# EAGLE design IrHeliJoy (EAGLE 5.11)
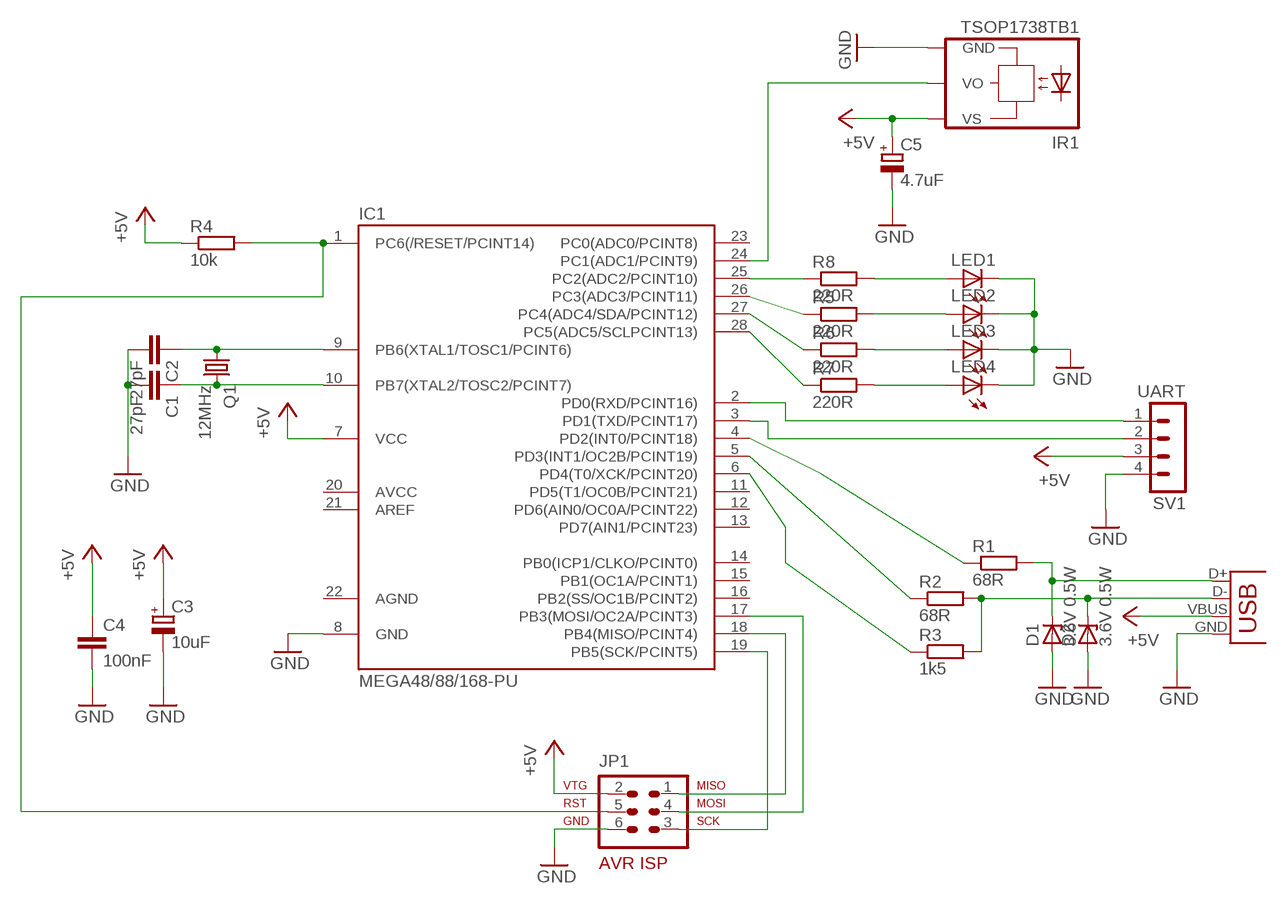
[diagram p0: schematic, sheet 1]

## Parts
C1  27pF  C-EU025-025X050  [C025-025X050]
C2  27pF  C-EU025-025X050  [C025-025X050]
C3  10uF  CPOL-EUE2,5-6E  [E2,5-6E]
C4  100nF  C-EU025-025X050  [C025-025X050]
C5  4.7uF  CPOL-EUE2.5-6  [E2,5-6]
D1  3.6V 0.5W  ZENER-DIODEDO34-7  [DO34Z7]
D2  3.6V 0.5W  ZENER-DIODEDO34-7  [DO34Z7]
IC1  MEGA48/88/168-PU  [DIL28-3]
IR1  TSOP1738TB1  [TSOP17_TB1]
JP1  AVR-ISP-6  [AVR-ISP-6]
LED1  LED3MM  [LED3MM]
LED2  LED3MM  [LED3MM]
LED3  LED3MM  [LED3MM]
LED4  LED3MM  [LED3MM]
Q1  12MHz  CRYSTALHC49U-V  [HC49U-V]
R1  68R  R-EU_0207/12  [0207/12]
R2  68R  R-EU_0207/12  [0207/12]
R3  1k5  R-EU_0207/15  [0207/15]
R4  10k  R-EU_0207/10  [0207/10]
R5  220R  R-EU_0207/10  [0207/10]
R6  220R  R-EU_0207/10  [0207/10]
R7  220R  R-EU_0207/10  [0207/10]
R8  220R  R-EU_0207/10  [0207/10]
SV1  UART  MA04-1  [MA04-1]
X1  USBPTH  [USB-B-PTH]

## Nets
+5V: C3.+ C4.1 C5.+ IC1.7(VCC) IR1.VS JP1.2 R4.1 SV1.3 X1.VBUS
GND: C1.2 C2.2 C3.- C4.2 C5.- D1.A D2.A IC1.8(GND) IR1.GND JP1.6 LED1.K(C) LED2.K(C) LED3.K(C) LED4.K(C) SV1.4 X1.GND
N$1: C1.1 IC1.10(PB7(XTAL2/TOSC2/PCINT7)) Q1.2
N$2: C2.1 IC1.9(PB6(XTAL1/TOSC1/PCINT6)) Q1.1
N$3: D1.C R1.2 X1.D+
N$4: IC1.4(PD2(INT0/PCINT18)) R1.1
N$5: D2.C R2.2 R3.2 X1.D-
N$6: IC1.5(PD3(INT1/OC2B/PCINT19)) R2.1
N$7: IC1.6(PD4(T0/XCK/PCINT20)) R3.1
N$8: IC1.25(PC2(ADC2/PCINT10)) R8.1
N$9: LED1.A R8.2
N$10: IC1.1(PC6(/RESET/PCINT14)) JP1.5 R4.2
N$11: IC1.18(PB4(MISO/PCINT4)) JP1.1
N$12: LED2.A R5.2
N$13: IC1.19(PB5(SCK/PCINT5)) JP1.3
N$14: IC1.17(PB3(MOSI/OC2A/PCINT3)) JP1.4
N$15: LED3.A R6.2
N$16: LED4.A R7.2
N$17: IC1.26(PC3(ADC3/PCINT11)) R5.1
N$18: IC1.27(PC4(ADC4/SDA/PCINT12)) R6.1
N$19: IC1.28(PC5(ADC5/SCLPCINT13)) R7.1
N$20: IC1.24(PC1(ADC1/PCINT9)) IR1.VO
N$21: IC1.2(PD0(RXD/PCINT16)) SV1.1
N$22: IC1.3(PD1(TXD/PCINT17)) SV1.2
Unconnected: IC1.11(PD5(T1/OC0B/PCINT21)) IC1.12(PD6(AIN0/OC0A/PCINT22)) IC1.13(PD7(AIN1/PCINT23)) IC1.14(PB0(ICP1/CLKO/PCINT0)) IC1.15(PB1(OC1A/PCINT1)) IC1.16(PB2(SS/OC1B/PCINT2)) IC1.20(AVCC) IC1.21(AREF) IC1.23(PC0(ADC0/PCINT8))

## Power pins joined to a net without a drawn wire
AGND: IC1.22(AGND)

## Library data of the parts
C1 C2 C4 = rcl:C-EU: CAPACITOR, European symbol
C3 C5 = rcl:CPOL-EU: POLARIZED CAPACITOR, European symbol
D1 D2 = diode:ZENER-DIODE: Z-Diode
IC1 = avr-4:MEGA48/88/168-PU
IR1 = telefunken:TSOP17*TB1: TSOP17..TB1 IR Receiver Modules for Remote Control Systems Source: http://www.vishay.com/docs/82042/82042.pdf; OC_FARNELL: unknown; OC_NEWARK: unknown
JP1 = avr-4:AVR-ISP-6: AVR ISP-6 Serial Programming Header
LED1-LED4 = led:LED: LED OSRAM: - CHIPLED LG R971, LG N971, LY N971, LG Q971, LY Q971, LO R971, LY R971 LH N974, LH R974 LS Q976, LO Q976, LY Q976 LO Q996 - Hyper CHIPLED LW Q18S LB Q993, LB Q99A, LB R99A - SideLED LS A670, LO A670, LY A670, LG A670, LP A670 LB A673, LV A673, LT A673, LW A673 LH A674 LY A675 LS A676, LA A676, LO A676, LY A676, LW A676 LS A679, LY A679, LG A679 - Hyper Micro SIDELED® LS Y876, LA Y876, LO Y876, LY Y876 LT Y87S - SmartLED LW L88C, LW L88S LB L89C, LB L89S, LG L890 LS L89K, LO L89K, LY L89K LS L896, LA L896, LO L896, LY L896 - TOPLED LS T670, LO T670, LY T670, LG T670, LP T670 LSG T670, LSP T670, LSY T670, LOP T670, LYG T670 LG T671, LOG T671, LSG T671 LB T673, LV T673, LT T673, LW T673 LH T674 LS T676, LA T676, LO T676, LY T676, LB T676, LH T676, LSB T676, LW T676 LB T67C, LV T67C, LT T67C, LS T67K, LO T67K, LY T67K, LW E67C LS E67B, LA E67B, LO E67B, LY E67B, LB E67C, LV E67C, LT E67C LW T67C LS T679, LY T679, LG T679 LS T770, LO T770, LY T770, LG T770, LP T770 LB T773, LV T773, LT T773, LW T773 LH T774 LS E675, LA E675, LY E675, LS T675 LS T776, LA T776, LO T776, LY T776, LB T776 LHGB T686 LT T68C, LB T68C - Hyper Mini TOPLED® LB M676 - Mini TOPLED Santana® LG M470 LS M47K, LO M47K, LY M47K Source: http://www.osram.convergy.de LUXEON: - LUMILED® LXK2-PW12-R00, LXK2-PW12-S00, LXK2-PW14-U00, LXK2-PW14-V00 LXK2-PM12-R00, LXK2-PM12-S00, LXK2-PM14-U00 LXK2-PE12-Q00, LXK2-PE12-R00, LXK2-PE12-S00, LXK2-PE14-T00, LXK2-PE14-U00 LXK2-PB12-K00, LXK2-PB12-L00, LXK2-PB12-M00, LXK2-PB14-N00, LXK2-PB14-P00, LXK2-PB14-Q00 LXK2-PR12-L00, LXK2-PR12-M00, LXK2-PR14-Q00, LXK2-PR14-R00 LXK2-PD12-Q00, LXK2-PD12-R00, LXK2-PD12-S00 LXK2-PH12-R00, LXK2-PH12-S00 LXK2-PL12-P00, LXK2-PL12-Q00, LXK2-PL12-R00 Source: www.luxeon.com KINGBRIGHT: KA-3528ASYC Source: www.kingbright.com
Q1 = crystal:CRYSTAL: CRYSTAL; OC_FARNELL: 1666969; OC_NEWARK: unknown
R1-R8 = rcl:R-EU_: RESISTOR, European symbol
SV1 = con-lstb:MA04-1: PIN HEADER; OC_FARNELL: unknown; OC_NEWARK: unknown
X1 = SparkFun:USB: USB Connectors USB-B-PTH is fully proven SKU : PRT-00139 USB-miniB is fully proven SKU : PRT-00587 USB-A-PCB is untested. USB-A-H is throughly reviewed, but untested. Spark Fun Electronics SKU : PRT-00437 USB-B-SMT is throughly reviewed, but untested. Needs silkscreen touching up. USB-A-S has not been used/tested USB-MB-H has not been used/tested

## Board
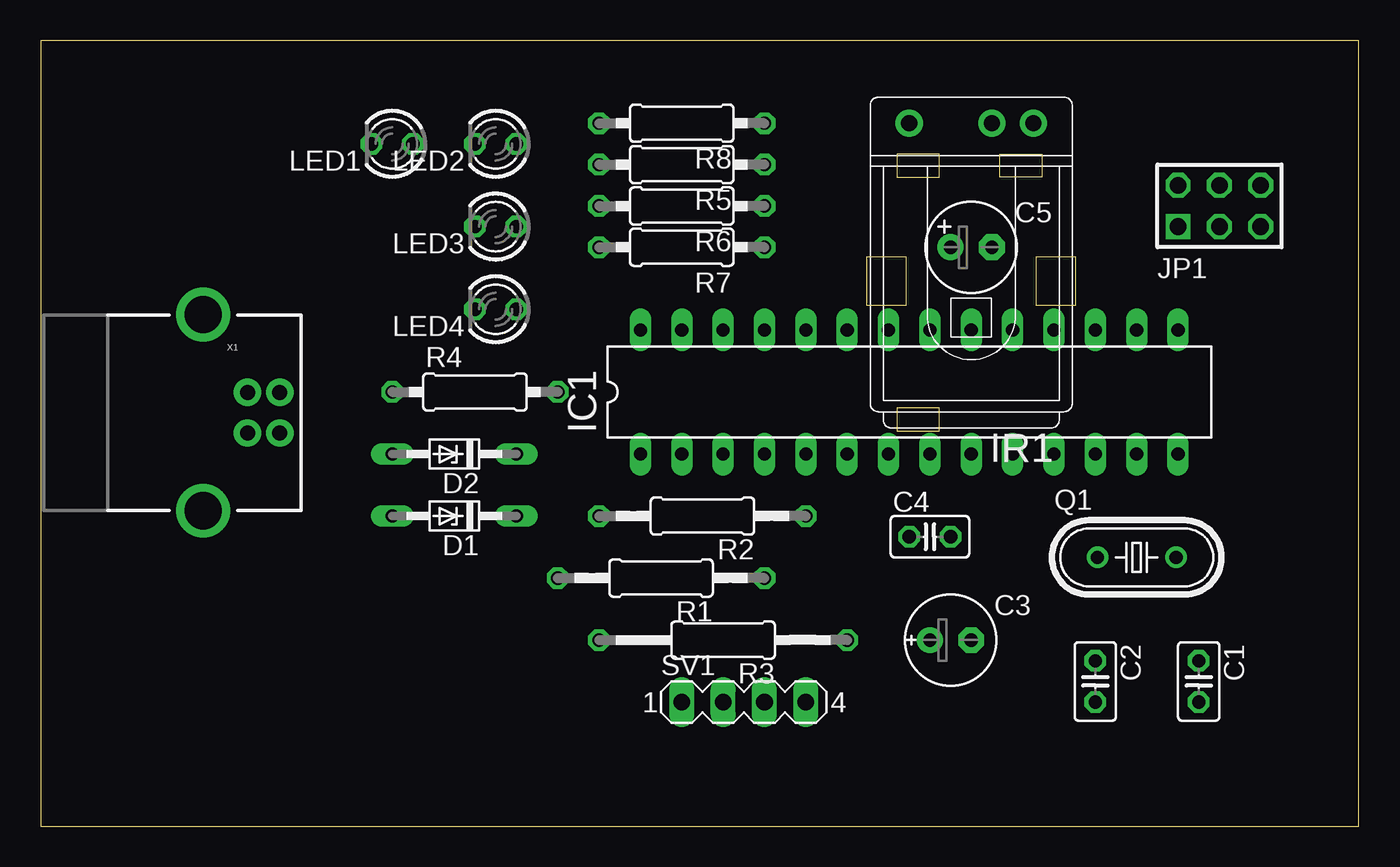
[diagram p1: board, top side]
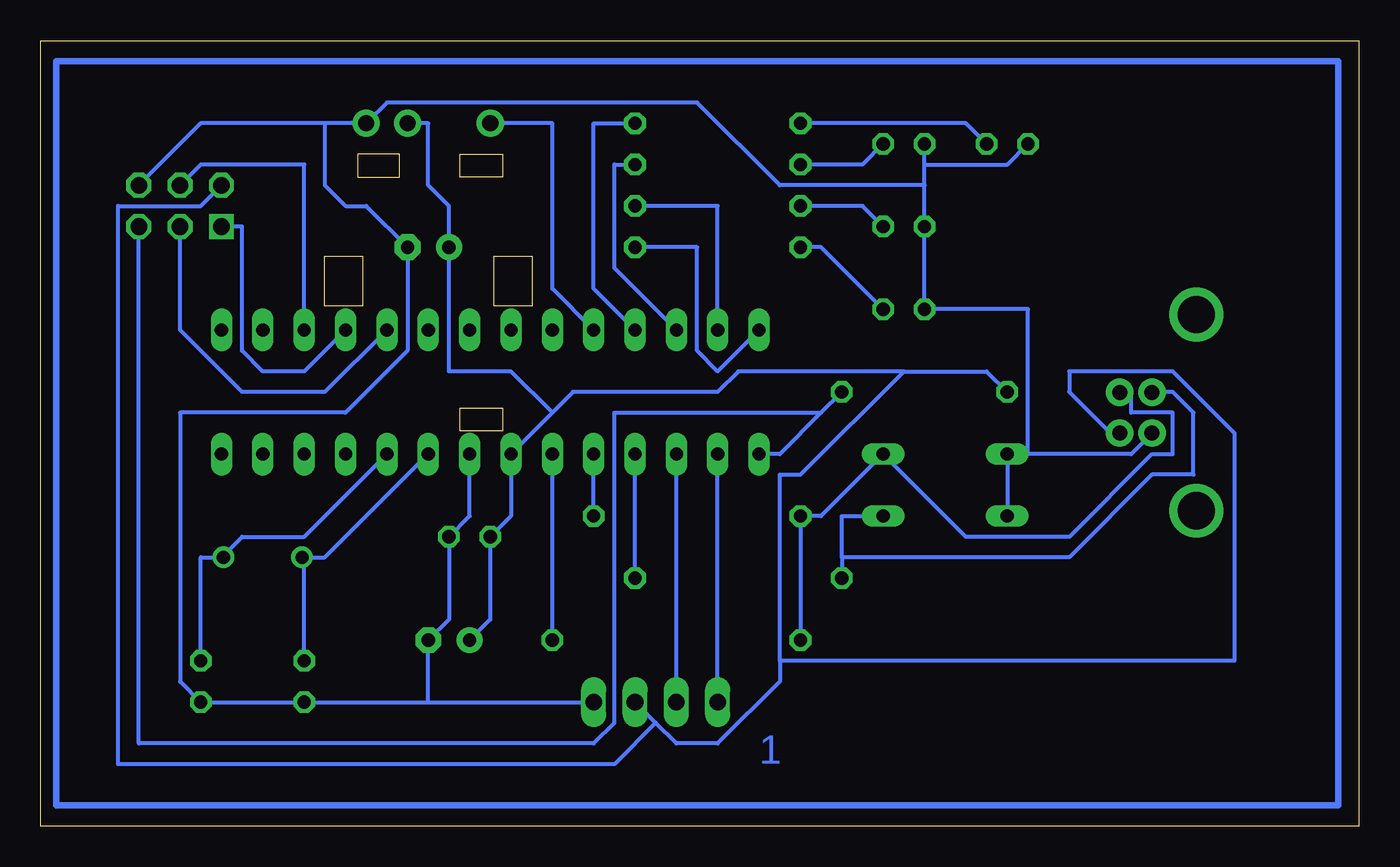
[diagram p2: board, bottom side, seen from below]

Size 80.95 x 48.25 mm. Coordinates in mm from the lower left corner, seen from the top.
Outline: 0,0 80.95,0 80.95,48.25 0,48.25 0,0
Copper layers (1*16): Top 0.035mm / dielectric 1.5mm / Bottom 0.035mm
Design rules "default *": minimum track width 10mil, minimum drill 24mil, track to track 8mil, track to pad 8mil, pad to pad 8mil, via to via 8mil, smd to smd 8mil, copper to edge 40mil, drill to drill 8mil, minimum pad ring 10mil, minimum via ring 8mil, stop-mask expansion 4mil, vias tented up to drill 0mil, thermal gap 10mil

### Footprints (pad centres in the part's own frame; a part is rotated, then mirrored left to right if it is on the bottom)
C025-025X050 = drill 0.813 octagon: 1 -1.27,0; 2 1.27,0
E2,5-6E = drill 0.813 pad 1.575 round: + -1.27,0 | drill 0.813 pad 1.575 octagon: - 1.27,0
E2,5-6 = drill 0.813 pad 1.6 round: + -1.27,0 | drill 0.813 pad 1.6 octagon: - 1.27,0
DO34Z7 = drill 0.813 long: A 3.81,0; C -3.81,0
DIL28-3 = drill 0.813 long: 1 -16.51,-3.81; 2 -13.97,-3.81; 3 -11.43,-3.81; 4 -8.89,-3.81; 5 -6.35,-3.81; 6 -3.81,-3.81; 7 -1.27,-3.81; 8 1.27,-3.81; 9 3.81,-3.81; 10 6.35,-3.81; 11 8.89,-3.81; 12 11.43,-3.81; 13 13.97,-3.81; 14 16.51,-3.81; 15 16.51,3.81; 16 13.97,3.81; 17 11.43,3.81; 18 8.89,3.81; 19 6.35,3.81; 20 3.81,3.81; 21 1.27,3.81; 22 -1.27,3.81; 23 -3.81,3.81; 24 -6.35,3.81; 25 -8.89,3.81; 26 -11.43,3.81; 27 -13.97,3.81; 28 -16.51,3.81
TSOP17_TB1 = drill 1 pad 1.676 round: GND 0,-3.81; VO 0,3.81; VS 0,-1.27
AVR-ISP-6 = drill 1.016 square: 1 -2.54,-1.27 | drill 1.016 octagon: 2 -2.54,1.27; 3 0,-1.27; 4 0,1.27; 5 2.54,-1.27; 6 2.54,1.27
LED3MM = drill 0.813 octagon: A -1.27,0; K 1.27,0
HC49U-V = drill 0.813 round: 1 -2.413,0; 2 2.413,0
0207/12 = drill 0.813 octagon: 1 -6.35,0; 2 6.35,0
0207/15 = drill 0.813 octagon: 1 -7.62,0; 2 7.62,0
0207/10 = drill 0.813 octagon: 1 -5.08,0; 2 5.08,0
MA04-1 = drill 1.016 long: 1 -3.81,0; 2 -1.27,0; 3 1.27,0; 4 3.81,0
USB-B-PTH = drill 0.914 pad 1.676 round: D+ 0,1.25; D- 1.981,1.25; GND 0,-1.25; VBUS 1.981,-1.25 | drill 2.286 round: S1 -2.718,-6.02; S2 -2.718,6.02

### Placement (x,y rotation side)
C1  71.12,8.89 270 top
C2  64.77,8.89 270 top
C3  55.88,11.43 0 top
C4  54.61,17.78 0 top
C5  57.15,35.56 0 top
D1  25.4,19.05 180 top
D2  25.4,22.86 180 top
IC1  53.34,26.67 0 top
IR1  57.15,43.18 90 top
JP1  72.39,38.1 0 top
LED1  21.59,41.91 180 top
LED2  27.94,41.91 180 top
LED3  27.94,36.83 180 top
LED4  27.94,31.75 180 top
Q1  67.31,16.51 0 top
R1  38.1,15.24 180 top
R2  40.64,19.05 180 top
R3  41.91,11.43 180 top
R4  26.67,26.67 0 top
R5  39.37,40.64 180 top
R6  39.37,38.1 180 top
R7  39.37,35.56 180 top
R8  39.37,43.18 180 top
SV1  43.18,7.62 0 top
X1  12.7,25.4 0 top

### Tracks (layer width: path | path; a pad name or v marks a point on that pad's centre or on a via)
+5V
  Bottom 0.254: IR1.VS 57.15,43.18 57.15,39.37 55.88,38.1 C5.+ 55.88,27.94 52.07,27.94 49.53,25.4 | C3.+ 53.34,12.7 C4.1 52.07,19.05 IC1.7 49.53,25.4 | R4.1 22.86,27.94 27.94,27.94 | 27.94,27.94 38.1,27.94 39.37,26.67 48.26,26.67 49.53,25.4 | 43.18,6.35 41.91,5.08 39.37,5.08 35.56,8.89 35.56,10.16 | 43.18,6.35 SV1.3 | 35.56,10.16 35.56,21.59 34.29,21.59 27.94,27.94 | JP1.2 71.12,38.1 76.2,38.1 76.2,3.81 45.72,3.81 43.18,6.35 | 35.56,10.16 7.62,10.16 7.62,24.13 11.43,27.94 17.78,27.94 17.78,26.67 15.24,24.13 X1.VBUS
GND
  Bottom 0.254: 26.67,39.37 LED3.K LED4.K 20.32,31.75 20.32,22.86 | 26.67,39.37 26.67,40.64 | 26.67,40.64 LED2.K | D1.A D2.A 20.32,22.86 | 57.15,7.62 C2.2 C1.2 72.39,8.89 72.39,25.4 62.23,25.4 58.42,29.21 C5.- 60.96,38.1 62.23,38.1 63.5,39.37 63.5,43.18 | 57.15,7.62 SV1.4 | 57.15,7.62 C3.- 55.88,12.7 C4.2 54.61,19.05 IC1.8 | LED1.K 21.59,40.64 26.67,40.64 | JP1.6 71.12,43.18 63.5,43.18 | 63.5,43.18 IR1.GND 59.69,44.45 40.64,44.45 35.56,39.37 26.67,39.37 | 20.32,22.86 13.97,22.86 12.7,24.13 X1.GND
N$1
  Bottom 0.254: C1.1 71.12,16.51 69.85,16.51 | IC1.10 64.77,17.78 68.58,17.78 69.85,16.51 | 69.85,16.51 Q1.2
N$2
  Bottom 0.254: C2.1 64.77,16.51 | IC1.9 63.5,16.51 64.77,16.51 | 64.77,16.51 Q1.1
N$3
  Bottom 0.254: 31.75,16.51 31.75,19.05 D1.C | 31.75,16.51 R1.2 | 31.75,16.51 17.78,16.51 12.7,21.59 10.16,21.59 10.16,25.4 11.43,26.67 12.7,26.67 X1.D+
N$4
  Bottom 0.254: R1.1 IC1.4
N$5
  Bottom 0.254: R3.2 R2.2 33.02,19.05 D2.C 24.13,17.78 17.78,17.78 12.7,22.86 11.43,22.86 11.43,25.4 13.97,25.4 13.97,26.67 X1.D-
N$6
  Bottom 0.254: R2.1 IC1.5
N$7
  Bottom 0.254: R3.1 IC1.6
N$8
  Bottom 0.254: IC1.25 46.99,33.02 46.99,43.18 R8.1
N$9
  Bottom 0.254: LED1.A 24.13,43.18 R8.2
N$10
  Bottom 0.254: 33.02,25.4 R4.2 | 33.02,25.4 35.56,22.86 IC1.1 | JP1.5 74.93,5.08 46.99,5.08 45.72,6.35 45.72,25.4 33.02,25.4
N$11
  Bottom 0.254: IC1.18 64.77,27.94 67.31,27.94 68.58,29.21 68.58,36.83 JP1.1
N$12
  Bottom 0.254: LED2.A 30.48,40.64 R5.2
N$13
  Bottom 0.254: IC1.19 63.5,26.67 68.58,26.67 72.39,30.48 JP1.3
N$14
  Bottom 0.254: IC1.17 64.77,40.64 71.12,40.64 JP1.4
N$15
  Bottom 0.254: LED3.A 30.48,38.1 R6.2
N$16
  Bottom 0.254: LED4.A 33.02,35.56 R7.2
N$17
  Bottom 0.254: IC1.26 45.72,34.29 45.72,40.64 R5.1
N$18
  Bottom 0.254: IC1.27 39.37,38.1 R6.1
N$19
  Bottom 0.254: IC1.28 39.37,27.94 40.64,29.21 40.64,35.56 R7.1
N$20
  Bottom 0.254: IC1.24 49.53,33.02 49.53,43.18 IR1.VO
N$21
  Bottom 0.254: SV1.1 IC1.2
N$22
  Bottom 0.254: SV1.2 IC1.3
N$23
  Bottom 0.406: 1.27,46.99 80.01,46.99 80.01,1.27 1.27,1.27 1.27,46.99

### Text on the board
Bottom: 1